# Altium schematic sheet power_supply.SchDoc
size Letter; DocumentNumber: 3; SheetNumber: 3; SheetTotal: 6
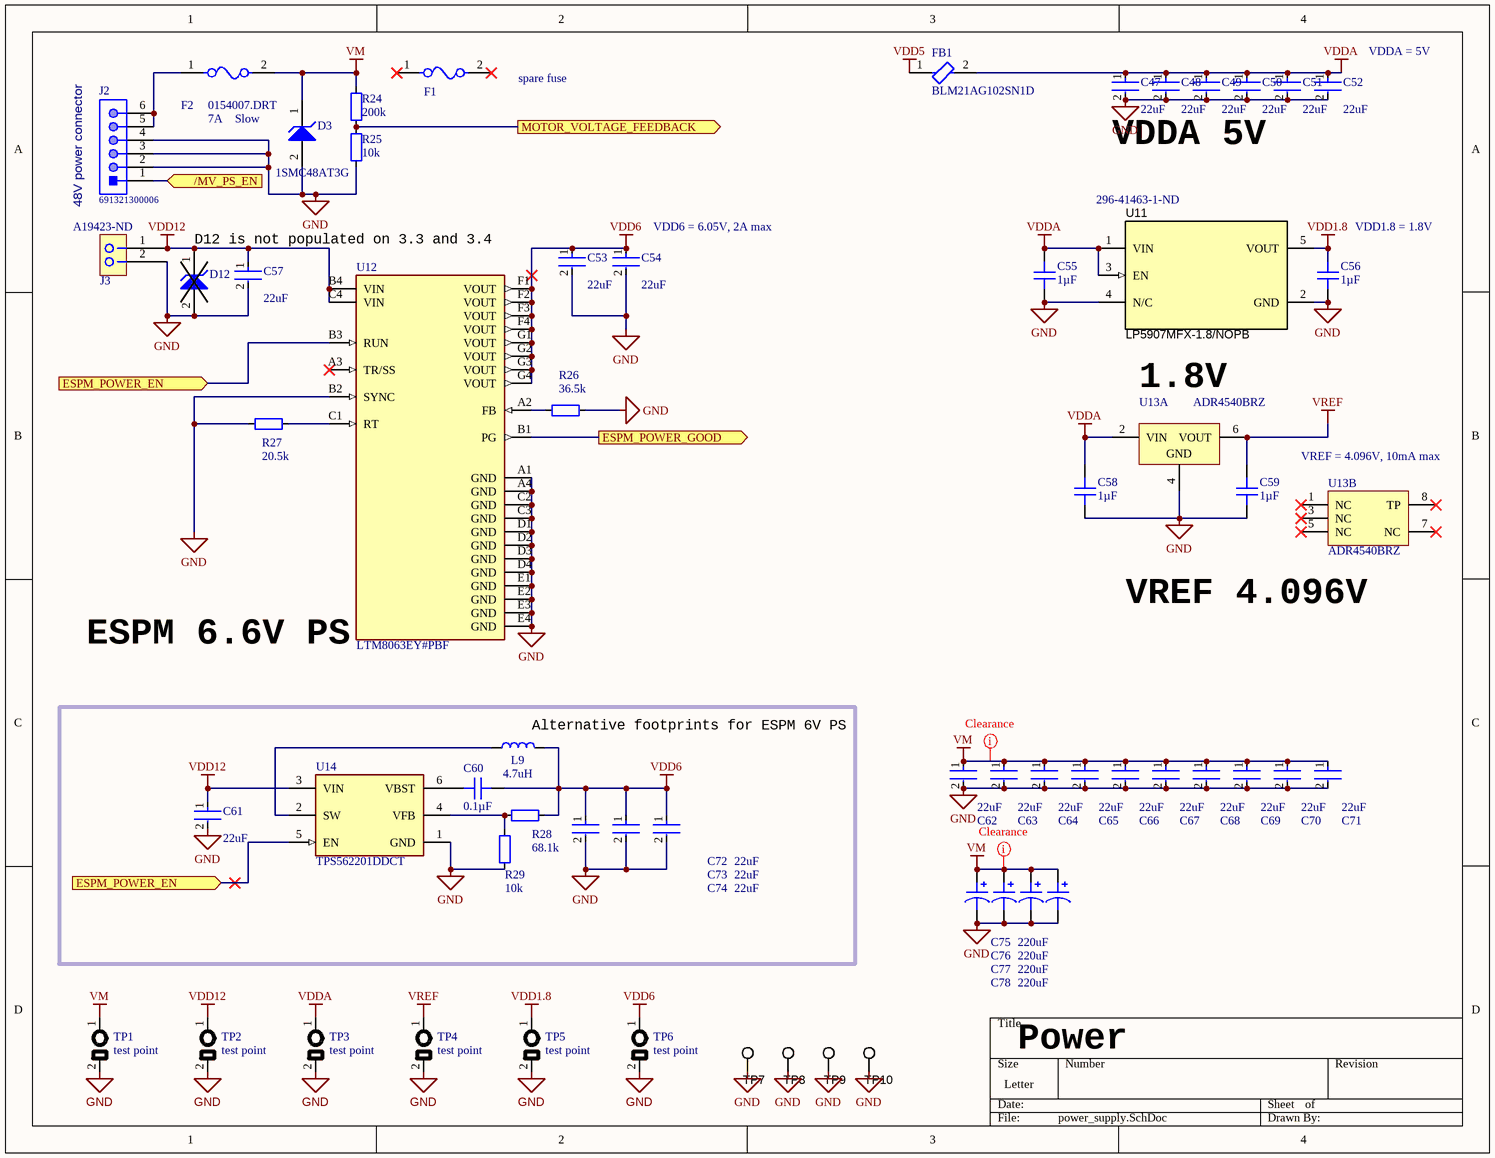
[diagram p0: power_supply.SchDoc]

## Parts
C47  Capacitance: 22uF  [FP-CL32-IPC_B]  (hidden comment: CL32B226MOJNNNE)
C48  Capacitance: 22uF  [FP-CL32-IPC_B]  (hidden comment: CL32B226MOJNNNE)
C49  Capacitance: 22uF  [FP-CL32-IPC_B]  (hidden comment: CL32B226MOJNNNE)
C50  Capacitance: 22uF  [FP-CL32-IPC_B]  (hidden comment: CL32B226MOJNNNE)
C51  Capacitance: 22uF  [FP-CL32-IPC_B]  (hidden comment: CL32B226MOJNNNE)
C52  Capacitance: 22uF  [FP-CL32-IPC_B]  (hidden comment: CL32B226MOJNNNE)
C53  Capacitance: 22uF  [FP-CL32-IPC_B]  (hidden comment: CL32B226MOJNNNE)
C54  Capacitance: 22uF  [FP-CL32-IPC_B]  (hidden comment: CL32B226MOJNNNE)
C55  1µF  [FP-GRM155-0_05-IPC_B]
C56  1µF  [FP-GRM155-0_05-IPC_B]
C57  Capacitance: 22uF  [FP-CL32-IPC_B]  (hidden comment: CL32B226MOJNNNE)
C58  1µF  [FP-GRM155-0_05-IPC_B]
C59  1µF  [FP-GRM155-0_05-IPC_B]
C60  0.1µF  [FP-GRM155-0_05-IPC_B]
C61  Capacitance: 22uF  [FP-CL32-IPC_B]  (hidden comment: CL32B226MOJNNNE)
C62  Capacitance: 22uF  [FP-KRM55W-6_1_5_3_6_7_1_2-MFG]  (hidden comment: KRM55WR72A226MH01L)
C63  Capacitance: 22uF  [FP-KRM55W-6_1_5_3_6_7_1_2-MFG]  (hidden comment: KRM55WR72A226MH01L)
C64  Capacitance: 22uF  [FP-KRM55W-6_1_5_3_6_7_1_2-MFG]  (hidden comment: KRM55WR72A226MH01L)
C65  Capacitance: 22uF  [FP-KRM55W-6_1_5_3_6_7_1_2-MFG]  (hidden comment: KRM55WR72A226MH01L)
C66  Capacitance: 22uF  [FP-KRM55W-6_1_5_3_6_7_1_2-MFG]  (hidden comment: KRM55WR72A226MH01L)
C67  Capacitance: 22uF  [FP-KRM55W-6_1_5_3_6_7_1_2-MFG]  (hidden comment: KRM55WR72A226MH01L)
C68  Capacitance: 22uF  [FP-KRM55W-6_1_5_3_6_7_1_2-MFG]  (hidden comment: KRM55WR72A226MH01L)
C69  Capacitance: 22uF  [FP-KRM55W-6_1_5_3_6_7_1_2-MFG]  (hidden comment: KRM55WR72A226MH01L)
C70  Capacitance: 22uF  [FP-KRM55W-6_1_5_3_6_7_1_2-MFG]  (hidden comment: KRM55WR72A226MH01L)
C71  Capacitance: 22uF  [FP-KRM55W-6_1_5_3_6_7_1_2-MFG]  (hidden comment: KRM55WR72A226MH01L)
C72  Capacitance: 22uF  [FP-CL32-IPC_B]  (hidden comment: CL32B226MOJNNNE)
C73  Capacitance: 22uF  [FP-CL32-IPC_B]  (hidden comment: CL32B226MOJNNNE)
C74  Capacitance: 22uF  [FP-CL32-IPC_B]  (hidden comment: CL32B226MOJNNNE)
C75  Capacitance: 220uF  [100TXW220MEFC10X40_horizontal]
C76  Capacitance: 220uF  [100TXW220MEFC10X40_horizontal]
C77  Capacitance: 220uF  [100TXW220MEFC10X40_horizontal]
C78  Capacitance: 220uF  [100TXW220MEFC10X40_horizontal]
D3  1SMC48AT3G  [ONSC-SMC-2-403-03_V]
D12  1SMA12AT3G  [ONSC-SMA-2-403D-02_F_V]  (value not drawn)
F1  0154007.DRT  [FP-0154-MFG]  (value not drawn)
F2  0154007.DRT  Fuse Current: 7A  Fuse Blow Speed: Slow  [FP-0154-MFG]
FB1  BLM21AG102SN1D  [FP-BLM21-0_2-t0_85-e0_5-MFG]
J2  691321300006  [691321300006]
J3  Supplier Part Number 1: A19423-ND  [HDR-2x1-100]  (hidden comment: Substitute with tyco 640457-2)
L9  4.7uH  [INDUCTOR-XAL7030]
R24  value 200k  [FP-CRCW0402-e3-IPC_B]  (hidden comment: Res_0402)
R25  value 10k  [FP-CRCW0402-e3-IPC_B]  (hidden comment: Res_0402)
R26  value 36.5k  [FP-CRCW0402-e3-IPC_B]  (hidden comment: Res_0402)
R27  value 20.5k  [FP-CRCW0402-e3-IPC_B]  (hidden comment: Res_0402)
R28  value 68.1k  [FP-CRCW0402-e3-IPC_B]  (hidden comment: Res_0402)
R29  value 10k  [FP-CRCW0402-e3-IPC_B]  (hidden comment: Res_0402)
TP1  test point  [TP_GND]  (no BOM)
TP2  test point  [TP_GND]  (no BOM)
TP3  test point  [TP_GND]  (no BOM)
TP4  test point  [TP_GND]  (no BOM)
TP5  test point  [TP_GND]  (no BOM)
TP6  test point  [TP_GND]  (no BOM)
TP7  5016  [Testpoint_Keystone_Compact]  (value not drawn)
TP8  5016  [Testpoint_Keystone_Compact]  (value not drawn)
TP9  5016  [Testpoint_Keystone_Compact]  (value not drawn)
TP10  5016  [Testpoint_Keystone_Compact]  (value not drawn)
U11  LP5907MFX-1.8/NOPB  Supplier Part Number 1: 296-41463-1-ND  [DBV0005A_N]
U12  LTM8063EY#PBF  [FP-BGA-28-05-08-1517-MFG]
U13  ADR4540BRZ  [ADI-R-8_M]  (parts A,B of 2)
U14  TPS562201DDCT  [FP-DDC0006A-IPC_C]

## Blocks framed on the sheet
Alternative footprints for ESPM 6V PS: C60 C61 C72-C74 L9 R28 R29 U14

## Ports
/MV_PS_EN (in), ESPM_POWER_EN (in), ESPM_POWER_GOOD (out), MOTOR_VOLTAGE_FEEDBACK (out)

## Nets
GND: C47.2 C48.2 C49.2 C50.2 C51.2 C52.2 C53.2 C54.2 C55.1 C56.1 C57.2 C58.1 C59.1 C61.2 C62.2 C63.2 C64.2 C65.2 C66.2 C67.2 C68.2 C69.2 C70.2 C71.2 C72.2 C73.2 C74.2 C75.2 C76.2 C77.2 C78.2 D3.2(A) D12.2(A) J2.2 J2.3 J2.4 J3.2 R25.1 R26.1 R27.2 R29.1 TP1.2(gnd) TP2.2(gnd) TP3.2(gnd) TP4.2(gnd) TP5.2(gnd) TP6.2(gnd) TP7.1 TP8.1 TP9.1 TP10.1 U11.2(GND) U11.4(N/C) U12.A1(GND) U12.A4(GND) U12.B2(SYNC) U12.C2(GND) U12.C3(GND) U12.D1(GND) U12.D2(GND) U12.D3(GND) U12.D4(GND) U12.E1(GND) U12.E2(GND) U12.E3(GND) U12.E4(GND) U13.4(GND) U14.1(GND)
VDD1.8: C56.2 TP5.1 U11.5(VOUT)
VDD5: FB1.1
VDD6: C53.1 C54.1 C60.2 C72.1 C73.1 C74.1 L9.2 R28.1 TP6.1 U12.F1(VOUT) U12.F2(VOUT) U12.F3(VOUT) U12.F4(VOUT) U12.G1(VOUT) U12.G2(VOUT) U12.G3(VOUT) U12.G4(VOUT)
VDD12: C57.1 C61.1 D12.1(K) J3.1 TP2.1 U12.B4(VIN) U12.C4(VIN) U14.3(VIN)
VDDA: C47.1 C48.1 C49.1 C50.1 C51.1 C52.1 C55.2 C58.2 FB1.2 TP3.1 U11.1(VIN) U11.3(EN) U13.2(VIN)
VM: C62.1 C63.1 C64.1 C65.1 C66.1 C67.1 C68.1 C69.1 C70.1 C71.1 C75.1 C76.1 C77.1 C78.1 D3.1(K) F2.2 R24.2 TP1.1
VREF: C59.2 TP4.1 U13.6(VOUT)
/MV_PS_EN: J2.1 ; port /MV_PS_EN
ESPM_POWER_EN: U12.B3(RUN) U14.5(EN) ; port ESPM_POWER_EN
ESPM_POWER_GOOD: U12.B1(PG) ; port ESPM_POWER_GOOD
MOTOR_VOLTAGE_FEEDBACK: R24.1 R25.2 ; port MOTOR_VOLTAGE_FEEDBACK
NetC60_1: C60.1 U14.6(VBST)
NetF2_1: F2.1 J2.5 J2.6
NetL9_1: L9.1 U14.2(SW)
NetR26_2: R26.2 U12.A2(FB)
NetR27_1: R27.1 U12.C1(RT)
NetR28_2: R28.2 R29.2 U14.4(VFB)

Not connected (* = marked no-connect by the designer): F1 1* 2*; U12 A3(TR/SS)*; U13 1(NC)* 3(NC)* 5(NC)* 7(NC)* 8(TP)*

## Layout directives
net class hv: VM

## Notes on the sheet
- spare fuse
- (near C52) VDDA = 5V
- VDDA 5V
- 48V power connector
- (near C54) VDD6 = 6.05V, 2A max
- (near C56) VDD1.8 = 1.8V
- D12 is not populated on 3.3 and 3.4
- 1.8V
- VREF = 4.096V, 10mA max
- (near U13) VREF 4.096V
- (near U12) ESPM 6.6V PS
- Power

## Library data of the parts
C47-C54 C57 C61 C72-C74 = CMP-13271-003818-1: Cap Ceramic 22uF 16V X7R ±20% SMD 1210 +125°C Embossed T/R; Mount: Surface Mount; Case/Package: 1210; Case Code (Imperial): 1210; Depth: 2.5mm; Packaging: Tape and Reel; Case Code (Metric): 3225; Package Quantity: 1; Min Operating Temperature: -55°C; Dielectric: X7R; Height: 2.5mm; Length: 3.2mm; Max Operating Temperature: 125°C; Thickness: 0.106inch; Width: 0.098inch; Tolerance: 20%; Voltage Rating: 16V; Radiation Hardening: No
C55 C56 C58 C59 = GRM155R70J105KA12J: CAP CER 1UF 6.3V X7R 0402; Manufacturer: Murata Electronics; Tolerance: ±10%; Value: 1µF; Part Number: GRM155R70J105KA12J; Applications: General Purpose; Capacitance: 1µF; ComponentLink1Description: Datasheet; ComponentLink1URL: https://search.murata.co.jp/Ceramy/image/img/A01X/G101/ENG/GRM155R70J105KA12-01.pdf; ComponentLink2Description: DigiKey Link; ComponentLink2URL: http://digikey.com/product-detail/en/murata-electronics/GRM155R70J105KA12J/490-13339-1-ND/5973350; Device Package: 0402 (1005 Metric); LastUpdated: 9/2/2020 1:02:22 AM; Lifecycle Status: Active; Minimum Order: 1; Mounting Type: Surface Mount, MLCC; Operating Temperature: -55°C ~ 125°C; Package / Case: 0402 (1005 Metric); Packaging: TapeAndReel; PartId: 2890; Part Status: Active; Price: 0.01; Series: GRM; Size / Dimension: 0.039" L x 0.020" W (1.00mm x 0.50mm); Supplier 1: DigiKey; Supplier Part Number 1: 490-13339-1-ND; Temperature Coefficient: X7R; Thickness (Max): 0.022" (0.55mm); Voltage - Rated: 6.3V
C60 = 04023C104KAT2A: CAP CER 0.1UF 25V X7R 0402; Manufacturer: AVX Corporation; Tolerance: ±10%; Value: 0.1µF; ComponentLink1Description: Datasheet; ComponentLink1URL: http://datasheets.avx.com/X7RDielectric.pdf; Supplier 1: DigiKey; Supplier Part Number 1: 478-7868-1-ND; Part Number: 04023C104KAT2A; Applications: General Purpose; Capacitance: 0.1µF; ComponentLink2Description: DigiKey Link; ComponentLink2URL: http://digikey.com/product-detail/en/avx-corporation/04023C104KAT2A/478-7868-1-ND/3881491; Device Package: 0402 (1005 Metric); LastUpdated: 9/2/2020 1:02:21 AM; Lifecycle Status: Active; Minimum Order: 1; Mounting Type: Surface Mount, MLCC; Operating Temperature: -55°C ~ 125°C; Package / Case: 0402 (1005 Metric); Packaging: CutTape; PartId: 3190; Part Status: Active; Price: 0.13; Series: -; Size / Dimension: 0.039" L x 0.020" W (1.00mm x 0.50mm); Temperature Coefficient: X7R; Thickness (Max): 0.022" (0.55mm); Voltage - Rated: 25V
C62-C71 = CMP-06035-003571-1: CAP CER 22UF 100V X7R SMD; Tolerance: 20%; Lead/Base Style: J-Lead; Packaging: Cut Tape; Mount: Surface Mount; Min Operating Temperature: -55°C; Max Operating Temperature: 125°C; Case/Package: SMD/SMT; Voltage Rating: 100V; Supplier 1: Arrow Electronics; Supplier Part Number 1: KRM55WR72A226MH01L
C75-C78 = Polarised Capacitor: TXW Series 100 V 220 uF 10 x 40 mm LS=5 mm Radial Aluminum Electrolytic; Manufacturer: Rubycon; Manufacturer Part Number: 100TXW220MEFC10X40; Voltage Rating: 100V; Tolerance: 20%; Ripple Current: 1.3A; Life (Hours): 10000Hour; Supplier 1: Newark; Supplier Part Number 1: 08X4753; RoHS: Yes; Category: Aluminum Electrolytic Capacitors; Stock 1: 1030; Pricing 1: 1=2.39000, 10=1.89000, 25=1.76000, 50=1.64000, 100=1.41000, 500=1.07000 (USD); Mount: Through Hole; Case/Package: Radial; Min Operating Temperature: -25°C; Max Operating Temperature: 105°C; Package Quantity: 500; Packaging: Bulk; Voltage Rating (DC): 100V; Series: TXW; Diameter: 10mm; Height: 40mm; Lead Pitch: 0.197inch; Height - Seated (Max): 1.654inch; REACH SVHC: No SVHC; Lead Free: Lead Free; RoHS Compliant: Yes; ComponentLink1URL: https://datasheet.ciiva.com/6315/e-txw-6315783.pdf?src-supplier=Digi-Key; ComponentLink1Description: https://datasheet.ciiva.com/6315/e-txw-6315783.pdf?src-supplier=Digi-Key; ComponentLink2URL: https://datasheet.ciiva.com/22732/1910944-22732303.pdf?src-supplier=Element14; ComponentLink2Description: https://datasheet.ciiva.com/22732/1910944-22732303.pdf?src-supplier=Element14
D3 = CMP-1061-00550-1: 1500 W Peak Power Zener Transient Voltage Suppressor, Unidirectional, 2-Pin SMC, Pb-Free, Tape and Reel; Manufacturer: On Semiconductor; IR Max (uA): 5; PPK Max (W): 1500; V(BR) Typ (V): 56.1; RoHS: Pb-Free; Packing: Tape and Reel; ComponentLink1Description: Manufacturer URL; ComponentLink3URL: http://www.onsemi.com/pub_link/Collateral/403-03.PDF; PackageReference: SMC-2-403-03; PackageDescription: 2-Pin Small Molded Package, J-Bend Lead, Body 5.845 x 6.855 mm; ComponentLink2URL: http://www.onsemi.com/pub_link/Collateral/1SMC5.0AT3-D.PDF; PackageVersion: Rev. E, 08/2005; Mounting Technology: Surface Mount; DatasheetVersion: Rev. 8; PartNumber: 1SMC48AT3G; ComponentLink3Description: Package Specification; ComponentLink2Description: Datasheet; ComponentLink1URL: http://www.onsemi.com/; Direction: Unidirectional
D12 = CMP-1061-00233-1: 400 W Peak Power Zener Transient Voltage Suppressor, 2-Pin SMA, Pb-Free, Tape and Reel; Manufacturer: On Semiconductor; V(BR) Typ (V): 14; PPK Max (W): 400; IR Max (uA): 2.5; Direction: Unidirectional; PackageVersion: Rev. F, 11/2008; ComponentLink2URL: http://www.onsemi.com/pub_link/Collateral/1SMA5.0AT3-D.PDF; PackageReference: SMA-2-403D-02_F; ComponentLink3Description: Package Specification; PartNumber: 1SMA12AT3G; ComponentLink1URL: http://www.onsemi.com/; Packing: Tape and Reel; ComponentLink1Description: Manufacturer URL; PackageDescription: 2-Pin Small Molded Package, J-Bend Lead, Body 2.605 x 4.315 mm; RoHS: Pb-Free; ComponentLink2Description: Datasheet; DatasheetVersion: Rev. 14; ComponentLink3URL: http://www.onsemi.com/pub_link/Collateral/1SMA5913BT3-D.PDF; Mounting Technology: Surface Mount
F1 = CMP-08605-000019-1: FUSE BRD MNT 7A 72VAC 60VDC 2SMD; Manufacturer: Littelfuse Inc; Max Fuse Dc Voltage: 60V; Fuse Blow Speed: Slow; Max Fuse Ac Voltage: 72V; Manufacturer Part Number: 0154007.DRT; RoHS: TRUE; Temperature Range High: +125°C; Temperature: -55°C to +125°C; Digikey Description: FUSE BRD MNT 7A 72VAC 60VDC 2SMD; Device Class L3: unset; Package: 0154; Lead Free: Yes; Fuse Current: 7A; Temperature Range Low: -55°C; Automotive: No; Height: 3.81mm; Octopart: https://octopart.com/0154007.drt-littelfuse-19644006; Device Class L2: Fuses; Category: Fuse; ComponentLink2URL: https://www.littelfuse.com/~/media/electronics/datasheets/fuses/littelfuse_fuse_154_154t_154l_154tl_datasheet.pdf.pdf; ComponentLink2Description: Datasheet; Device Class L1: Circuit Protection; Mouser Description: Surface Mount Fuses ACS SMF OMNI-BLOK SB RoHS 7A
F2 = CMP-08605-000019-1: FUSE BRD MNT 7A 72VAC 60VDC 2SMD; Manufacturer: Littelfuse Inc; Max Fuse Dc Voltage: 60V; Max Fuse Ac Voltage: 72V; Manufacturer Part Number: 0154007.DRT; RoHS: TRUE; Temperature Range High: +125°C; Temperature: -55°C to +125°C; Digikey Description: FUSE BRD MNT 7A 72VAC 60VDC 2SMD; Device Class L3: unset; Package: 0154; Lead Free: Yes; Temperature Range Low: -55°C; Automotive: No; Height: 3.81mm; Octopart: https://octopart.com/0154007.drt-littelfuse-19644006; Device Class L2: Fuses; Category: Fuse; ComponentLink2URL: https://www.littelfuse.com/~/media/electronics/datasheets/fuses/littelfuse_fuse_154_154t_154l_154tl_datasheet.pdf.pdf; ComponentLink2Description: Datasheet; Device Class L1: Circuit Protection; Mouser Description: Surface Mount Fuses ACS SMF OMNI-BLOK SB RoHS 7A
FB1 = CMP-0686-00665-3: Chip Ferrite Bead, 0805, 1000Ω @ 100MHz, 0.27Ω, 25%, 600mA; Material: Steel; Number of Lines: 1; Current Rating: 500mA; Max DC Current: 200mA; Impedance: 1kR; DC Resistance (DCR): 280mR; Shielding: Unshielded; Length: 2mm; Max Current Rating: 600mA; Max Operating Temperature: 125°C; Lead Free: Lead Free; Test Frequency: 100MHz; Number of Pins: 2; Height: 0.85mm; Package Quantity: 1; Termination: SMD/SMT; Depth: 1.25mm; Radiation Hardening: No; Case Code (Metric): 2012; Tolerance: 25%; Core Material: Ferrite; Min Operating Temperature: -55°C; Case Code (Imperial): 0805; Weight: 0.000194oz; DC Current: 200mA; Case/Package: 0805; REACH SVHC: No SVHC; Frequency: 100MHz; Military Standard: Not; Number of Circuits: 1; Width: 1.25mm; Packaging: Tape and Reel
J2 = CMP-1502-01867-1: Serie 321 - 3.81mm Vertical PCB Header WR-TBL, 6 pin; Manufacturer: Wurth Elektronik; Gender: Male; Pin Number: 6; Pitch: 3.81mm; Manufacturer URL: http://www.we-online.de; Part Number: 691321300006; Datasheet URL: http://katalog.we-online.de/em/datasheet/6913213000xx.pdf; Mounting Technology: THT; Packaging: Box; Publisher: WurthElektronik; Operating Temperature: -40to105degC; Package Reference: 691321300006
J3 = HEADER 2: TE Connectivity MTA-100 Series, 2.54mm Pitch 2 Way 1 Row Straight PCB Header, Solder Termination, 5A; system: connector; Voltage Rating: 250V; Number of Contacts: 2; Plating Thickness: 3.81um; Shrouded: No (Without); Contact Resistance: 6mR; Gender: Male; Underplate Material: Nickel; Connector Type: Plug,Header,Pin; Connector System: Wire-to-Board; PCB Mount Retention: Without; PCB Mounting Orientation: Vertical; Contact Post Length: 3.56mm; PCB Thickness: 0.063inch; Approvals: CSA; Manufacturer: TE Connectivity; Manufacturer Part Number: 640457-2; Stock 1: 10901; Pricing 1: 1=0.14, 10=0.127, 100=0.0783, 500=0.06482, 1000=0.05672, 5000=0.04862, 10000=0.04727 (USD); Mount: Through Hole; Colour: White,Natural,Beige; Contact Plating: Tin; Min Operating Temperature: -67°C; Max Operating Temperature: 221°C; Packaging: Bulk; Fastening Type: Friction; Current Rating: 5A; Contact Gender: Male; Termination: Solder; Orientation: Right Angle; Contact Current Rating: 5A; Max Voltage Rating (AC): 250V; Contact Mating Length: 0.295inch; Termination Post Length: 3.56mm; Depth: 11.04mm; Radiation Hardening: No; Flammability Rating: UL94 V-0; ELV: Compliant; Lead Free: Lead Free; REACH SVHC: Unknown; ComponentLink1URL: https://datasheet.ciiva.com/709/eng-cd-640457-s2-709682.pdf; ComponentLink1Description: https://datasheet.ciiva.com/709/eng-cd-640457-s2-709682.pdf; ComponentLink2URL: https://datasheet.ciiva.com/14640/70083657-14640359.pdf; ComponentLink2Description: https://datasheet.ciiva.com/14640/70083657-14640359.pdf; ComponentLink3URL: https://datasheet.ciiva.com/3118/eng-ds-82056-mta-0608-3118505.pdf; ComponentLink3Description: https://datasheet.ciiva.com/3118/eng-ds-82056-mta-0608-3118505.pdf; ComponentLink4URL: https://datasheet.ciiva.com/11750/0900766b806a960f-11750281.pdf; ComponentLink4Description: https://datasheet.ciiva.com/11750/0900766b806a960f-11750281.pdf; ComponentLink5URL: https://datasheet.ciiva.com/30192/8852eng-ds-82056-mta-0608-30192537.pdf; ComponentLink5Description: https://datasheet.ciiva.com/30192/8852eng-ds-82056-mta-0608-30192537.pdf; ComponentLink6URL: https://datasheet.ciiva.com/16395/eng-ds-82056-mta-0608-16395963.pdf; ComponentLink6Description: https://datasheet.ciiva.com/16395/eng-ds-82056-mta-0608-16395963.pdf; ComponentLink7URL: https://datasheet.ciiva.com/25618/0900766b80e9e25b-25618125.pdf; ComponentLink7Description: https://datasheet.ciiva.com/25618/0900766b80e9e25b-25618125.pdf; ComponentLink8URL: https://datasheet.ciiva.com/16505/eng-ds-82056-mta-0608-16505423.pdf; ComponentLink8Description: https://datasheet.ciiva.com/16505/eng-ds-82056-mta-0608-16505423.pdf; ComponentLink9URL: https://datasheet.ciiva.com/16656/eng-ds-82056-mta-0608-16656527.pdf; ComponentLink9Description: https://datasheet.ciiva.com/16656/eng-ds-82056-mta-0608-16656527.pdf; RoHS: Yes; Category: Connectors; Stock 2: 28315; Pricing 2: 1=0.10000, 10=0.09400, 100=0.05800, 500=0.04802, 1000=0.04202, 5000=0.03601, 10000=0.03501 (USD); Contact Material: Copper Alloy; Color: Natural,White,Beige; Housing Color: Natural; Housing Material: Polyester; Contact Shape: Square; Number of Rows: 1; Package Quantity: 1; Number of Positions: 2; Backwall/Post Interruptions: No (Without); Contact Retention: No (Without); Mating Alignment: No (Without); Mating Retention: No (Without); PCB Mount Alignment: No (Without); Sealable: No (Without); Strain Relief: No (Without); Contact Style: Straight; Series: MTA-100; Contact Type: Male Pin; Length: 5.08mm; Height: 7.75mm; Pitch: 2.54mm; Tail Length: 3.56mm; RoHS Compliant: Yes; ComponentLink10URL: https://datasheet.ciiva.com/15175/getdatasheetpartid-46749-15175703.pdf?src-supplier=Verical; ComponentLink10Description: https://datasheet.ciiva.com/15175/getdatasheetpartid-46749-15175703.pdf?src-supplier=Verical; ComponentLink11URL: https://datasheet.ciiva.com/16394/eng-ds-82056-mta-0608-16394202.pdf?src-supplier=Future+Electronics; ComponentLink11Description: https://datasheet.ciiva.com/16394/eng-ds-82056-mta-0608-16394202.pdf?src-supplier=Future+Electronics; ComponentLink12URL: https://datasheet.ciiva.com/6045/1650873-6045536.pdf?src-supplier=Farnell; ComponentLink12Description: https://datasheet.ciiva.com/6045/1650873-6045536.pdf?src-supplier=Farnell; ComponentLink13URL: https://datasheet.ciiva.com/11746/0900766b806b3bd3-11746906.pdf?src-supplier=RSComponents; ComponentLink13Description: https://datasheet.ciiva.com/11746/0900766b806b3bd3-11746906.pdf?src-supplier=RSComponents; ComponentLink14URL: https://datasheet.ciiva.com/7703/eng-ds-82056-mta-0608-7703518.pdf?src-supplier=Element14; ComponentLink14Description: https://datasheet.ciiva.com/7703/eng-ds-82056-mta-0608-7703518.pdf?src-supplier=Element14; ComponentLink15URL: https://datasheet.ciiva.com/3118/eng-ds-82056-mta-0608-3118490.pdf?src-supplier=Avnet; ComponentLink15Description: https://datasheet.ciiva.com/3118/eng-ds-82056-mta-0608-3118490.pdf?src-supplier=Avnet; ComponentLink16URL: https://datasheet.ciiva.com/709/eng-cd-640454-y2-709679.pdf?src-supplier=Digi-Key; ComponentLink16Description: https://datasheet.ciiva.com/709/eng-cd-640454-y2-709679.pdf?src-supplier=Digi-Key; ComponentLink17URL: https://datasheet.ciiva.com/16684/eng-ds-82056-mta-0608-16684984.pdf?src-supplier=Avnet+Europe; ComponentLink17Description: https://datasheet.ciiva.com/16684/eng-ds-82056-mta-0608-16684984.pdf?src-supplier=Avnet+Europe; Supplier 1: Digi-Key
L9 = INDUCTOR
R24-R29 = Res_0402: Resistor
TP1-TP6 = TP_GND
TP7-TP10 = 5016: Test Point, Compact, SMT; Manufacturer: Keystone; CompType: Test Point Loop; SymbolVersion: 2008-04-04; PartNumber: 5016; PackageReference: Testpoint_Keystone_Compact; RoHS: Y; MountType: SMT; ComponentLink1Description: Datasheet URL; ComponentLink1URL: http://www.keyelco.com/userAssets/store/files/5016.PDF; Publisher: Texas Instruments; LatestRevisionDate: 2016-09-14; Supplier 1: Digi-Key; Supplier Part Number 1: 36-5016TR-ND; Supplier 2: Mouser; Supplier Part Number 2: 534-5016
U11 = LP5907MFX-3.3/NOPB: Ultra Low Noise, 250mA Linear Regulator; Manufacturer: Texas Instruments; SymbolCreator: a0799628; SizeArea_mm2: 8.12; SizeAreaWB_mm2: 14.82; SizeX_mm: 2.8; SizeY_mm: 2.9; SizeZ_mm: 1.45; CompType: IC; U/M: EA; Min Input Voltage: 2.2V; Number of Outputs: 1; Output Voltage: 1.8V; Dropout Voltage: 250mV; Max Input Voltage: 5.5V; Polarity: Positive; Quiescent Current: 25uA; Output Voltage Accuracy: 2%; Power Supply Rejection Ratio (PSRR): 82dB; Output Type: Fixed; SymbolVersion: 2014-03-21; PartNumber: LP5907MFX-1.8/NOPB; PackageReference: DBV0005A; PackageDescription: SOT-5; MountType: SMT; ComponentLink1Description: Datasheet Link; ComponentLink1URL: http://www.ti.com/lit/ds/symlink/lp5907.pdf; RoHS: Y; Publisher: Texas Instruments; LatestRevisionDate: 2016-09-20; Alternate Manufacturer: Texas Instruments; Supplier 1: Digi-Key; Manufacturer Part Number: LP5907MFX-1.8/NOPB; Category: Voltage Regulators - Linear; Stock 1: 17882; Pricing 1: 1=0.57000, 10=0.48900, 25=0.45640, 100=0.33900, 250=0.28684, 500=0.27380, 1000=0.20209 (USD); Mount: Surface Mount; Case/Package: SOT-23; Number of Pins: 5; Contact Plating: Tin; Min Operating Temperature: -40°C; Max Operating Temperature: 125°C; Packaging: Tape and Reel; Package Quantity: 3000; Output Current: 250mA; Number of Regulators: 1; Nominal Output Voltage: 1.8V; Accuracy: 2%; Max Output Current: 250mA; REACH SVHC: No SVHC; Lead Free: Lead Free; RoHS Compliant: Yes; ComponentLink2URL: https://datasheet.ciiva.com/15083/lp5907-15083594.pdf?src-supplier=Digi-Key; ComponentLink2Description: https://datasheet.ciiva.com/15083/lp5907-15083594.pdf?src-supplier=Digi-Key
U12 = CMP-09139-000005-1: DC DC CONVERTER 0.8-15V; Manufacturer: Analog Devices; Standoff Height: 0.3mm; Output Current: 2uA; Switching Frequency: 200-2200kHz; Max Supply Voltage: 40V; Min Supply Voltage: 3.2V; Output Type: AdjustableProgrammable; Max Junction Temp: +125°C; Number Of Outputs: 1; Nominal Supply Current: 3-8uA; Switching Topology: Buck; ComponentLink2URL: https://www.analog.com/media/en/technical-documentation/data-sheets/LTM8063.pdf; Height: 2.42mm; Temperature Range Low: -40°C; Mouser Description: Module DC-DC 1-OUT 0.8V to 15V 2A Automotive 28-Pin BGA Tray; Temperature Range High: +125°C; Octopart: https://octopart.com/ltm8063ey%23pbf-analog+devices-88947122; Category: IC; Device Class L3: Voltage Regulators - Switching; Output Voltage: 0.8-15V; Manufacturer Part Number: LTM8063EY#PBF; Package: BGA-28-05-08-1517; Automotive: No; RoHS: TRUE; Device Class L1: Integrated Circuits (ICs); Digikey Description: DC DC CONVERTER 0.8-15V; Ipc Land Pattern Name: BGA28C80P4X7_625X400X242; Lead Free: Yes; Temperature: -40°C to +125°C; Device Class L2: Power Management ICs; ComponentLink2Description: Datasheet
U13 = CMP-0784-00192-1: Ultralow Noise, High Accuracy Voltage Reference, 4.096 V Output, 3 to 15 V Supply, Industrial, 8-pin SOIC (R-8), Tube; Manufacturer: Analog Devices; Max V Supply (V): 15; Min V Supply (V): 3; Vout: 4.096V; Ref Out TC (ppm/C): 2; ComponentLink4URL: Product URL:http://www.analog.com/en/special-linear-functions/voltage-references/adr4540/products/product.html; Mounting Technology: Surface Mount; ComponentLink1Description: Manufacturer URL; PackageDescription: 8-Pin Standard Small Outline Package, Body 4.9 x 3.9 mm, Pitch 1.27 mm; ComponentLink2URL: http://www.analog.com/static/imported-files/data_sheets/ADR4520_4525_4530_4533_4540_4550.pdf; ComponentLink1URL: http://www.analog.com/en/index.html; DatasheetVersion: Rev. 0; ComponentLink4Description: URL Link1; Operating Temp Range: -40 to 125 degC; PartNumber: ADR4540BRZ; ComponentLink2Description: Datasheet; ComponentLink3URL: http://www.analog.com/static/imported-files/packages/PKG_PDF/SOIC_Narrow%20(R)/R_8.pdf; ComponentLink3Description: Package Specification; PackageVersion: 060506-A, 06/2006; Packing: Tube; PackageReference: R-8; Code_JEDEC: MS-012-AA; Supplier 1: Digi-Key; Supplier Part Number 1: ADR4540BRZ-ND
U14 = CMP-04918-000010-1: IC REG BUCK ADJ 2A TSOT23-6; Manufacturer: Texas Instruments; Min Supply Voltage: 4.5V; Nominal Supply Current: 380uA; Output Type: AdjustableProgrammable; Standoff Height: 0mm; Max Supply Voltage: 17V; Output Voltage: 0.76-7V; Max Duty Cycle: 80%; Switching Frequency: 580kHz; Number Of Outputs: 1; Max Junction Temp: +125°C; Temperature Range Low: -40°C; Device Class L2: Power Management ICs; Package: DDC0006A; Switching Topology: Buck; Manufacturer Part Number: TPS562201DDCT; Category: IC; RoHS: TRUE; Digikey Description: IC REG BUCK ADJ 2A TSOT23-6; Height: 1.1mm; Temperature: -40°C to +125°C; Temperature Range High: +125°C; Octopart: https://octopart.com/tps562201ddct-texas+instruments-68059584; Lead Free: Yes; ComponentLink2URL: http://www.ti.com/lit/ds/symlink/tps562201.pdf; Device Class L3: Voltage Regulators - Switching; Device Class L1: Integrated Circuits (ICs); Output Current: 2A; ComponentLink2Description: Datasheet; Mouser Description: Conv DC-DC 4.5V to 17V Synchronous Step Down Single-Out 0.76V to 7V 2A 6-Pin TSOT-23 T/R; Automotive: No